# Altium schematic sheet 18V5_efuse.SchDoc
size A4
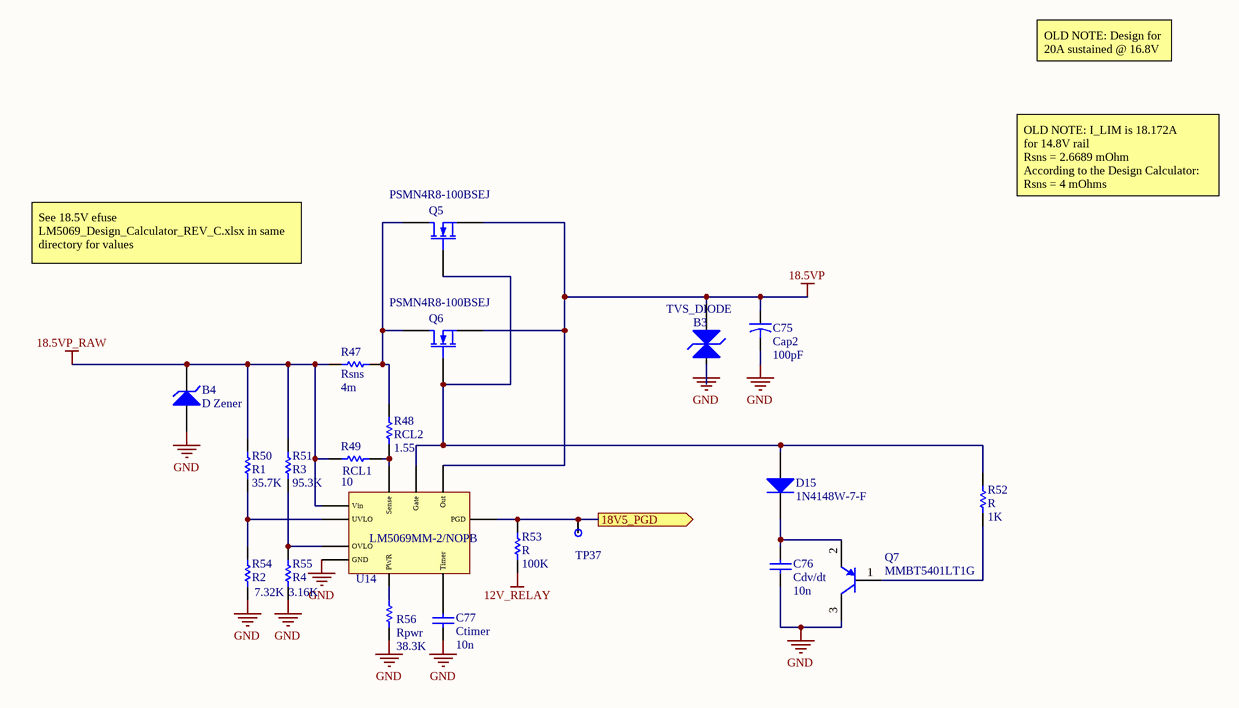
[diagram p0: 18V5_efuse.SchDoc]

## Parts
B3  TVS_DIODE  [SMBJ54A-13-F]
B4  D Zener  [DIODE-0.7]
C75  Cap2  value 100pF  [CAPR5-4X5]
C76  Cdv/dt  value 10n  [RAD-0.3]
C77  Ctimer  value 10n  [RAD-0.3]
D15  1N4148W-7-F  [DIOD-SOD123-2_V]
Q5  PSMN4R8-100BSEJ  [DPAK254P1420X457-3N]
Q6  PSMN4R8-100BSEJ  [DPAK254P1420X457-3N]
Q7  MMBT5401LT1G  [ONSC-SOT-23-3-318-08_V]
R47  Rsns  value 4m  [RESC1608X06N_0603]
R48  RCL2  value 1.55  [RESC1608X06N_0603]
R49  RCL1  value 10  [RESC1608X06N_0603]
R50  R1  value 35.7K  [RESC1608X06N_0603]
R51  R3  value 95.3K  [RESC1608X06N_0603]
R52  R  value 1K  [RESC1608X06N_0603]
R53  R  value 100K  [RESC1608X06N_0603]
R54  R2  value 7.32K  [RESC1608X06N_0603]
R55  R4  value 3.16K  [RESC1608X06N_0603]
R56  Rpwr  value 38.3K  [RESC1608X06N_0603]
TP37  TestPt  [50_MIL_PAD]  (value not drawn)
U14  LM5069MM-2/NOPB  [TSSOP50P490X110-10N]

## Ports
18V5_PGD (out)

## Nets
12V_RELAY: R53.1
18.5VP: B3.2(K) C75.1 Q5.3(S) Q6.3(S) U14.9(Out)
18.5VP_RAW: B4.2(K) R47.1 R49.1 R50.2 R51.2 U14.2(Vin)
GND: B3.1(A) B4.1(A) C75.2 C76.2 C77.1 Q7.3(C) R54.1 R55.1 R56.1 U14.5(GND)
18V5_PGD: R53.2 TP37.1 U14.8(PGD) ; port 18V5_PGD
NetC76_1: C76.1 D15.2(K) Q7.2(E)
NetC77_2: C77.2 U14.6(Timer)
NetD15_1: D15.1(A) Q5.1(G) Q6.1(G) R52.2 U14.10(Gate)
NetQ5_2: Q5.2(D) Q6.2(D) R47.2 R48.2
NetQ7_1: Q7.1(B) R52.1
NetR48_1: R48.1 R49.2 U14.1(Sense)
NetR50_1: R50.1 R54.2 U14.3(UVLO)
NetR51_1: R51.1 R55.2 U14.4(OVLO)
NetR56_2: R56.2 U14.7(PWR)

## Notes on the sheet
- OLD NOTE: Design for 20A sustained @ 16.8V
- OLD NOTE: I_LIM is 18.172A
  for 14.8V rail
  Rsns = 2.6689 mOhm                            According to the Design Calculator: Rsns = 4 mOhms
- See 18.5V efuse LM5069_Design_Calculator_REV_C.xlsx in same directory for values

## Library data of the parts
B3 = TVS_DIODE: TVS Diode; Published: 8-Jun-2000; LatestRevisionDate: 17-Jul-2002; LatestRevisionNote: Re-released for DXP Platform.; PackageVersion: Sep-1996; PackageReference: SMC; Publisher: Altium Limited; PackageDescription: DO-214-AB/SMC; 2 C-Bend Leads; Body 7.9 x 5.9 mm, inc. leads (LxW); Code_JEDEC: DO-214-AB
B4 = D Zener: Zener Diode; Published: 8-Jun-2000; LatestRevisionDate: 17-Jul-2002; LatestRevisionNote: Re-released for DXP Platform.; PackageReference: DIODE-0.7; Publisher: Altium Limited; PackageDescription: Diode, Thru-Hole; 2 Leads; 0.7 in Pin Spacing
C75 = Cap2: Capacitor; Published: 23-Sep-2002; PackageReference: CAPR5-4X5; Publisher: Altium Limited; PackageDescription: Capacitor; 2 Leads
C76 C77 = Cap: Capacitor; Published: 8-Jun-2000; LatestRevisionDate: 17-Jul-2002; LatestRevisionNote: Re-released for DXP Platform.; PackageReference: RAD-0.3; Publisher: Altium Limited; PackageDescription: Radial Cap, Thru-Hole; 2 Leads; 0.3 in Pin Spacing
D15 = CMP-2000-04932-2: Fast Switching Diode, 100 V, 0.15 A, -65 to 150 degC, 2-Pin?SOD123, RoHS, Tape and Reel; Recovery Time: 4ns; Brand: DiodesIncorporated; Unit Weight: 0.000353oz; Max Surge Current: 2A; Peak Reverse Voltage: 100V; Ir - Reverse Current: 1uA; Vf - Forward Voltage: 1.25V; Configuration: Single; If - Forward Current: 0.15A; Product Category: Diodes-GeneralPurpose,Power,Switching; Operating Temperature Range: -65Cto+150C; Packaging: Reel; Manufacturer URL: http://www.diodes.com/; Maximum Operating Temperature: +150C; Height: 1.25mm; Minimum Operating Temperature: -65C; Product: SwitchingDiodes; Package URL: http://www.diodes.com/datasheets/ds18004.pdf; Type: SwitchingDiode; Package Reference: SOD123-2; Width: 1.7mm; Datasheet URL: http://www.farnell.com/datasheets/1915529.pdf; Datasheet Version: Rev. 24-2, 10/2013; Series: 1N4148; Factory Pack Quantity: 3000; Length: 2.85mm; RoHS: True; Manufacturer: DiodesIncorporated; Mounting Style: SMD/SMT; Package / Case: SOD-123
Q5 Q6 = PSMN4R8-100BSEJ: N-Channel MOSFET; Published: 8-Jun-2000; LatestRevisionDate: 17-Jul-2002; LatestRevisionNote: Re-released for DXP Platform.; PackageVersion: 1995/1996; PackageReference: E3; Publisher: Altium Limited; PackageDescription: TO, Flat Index; 3 In-Line, Axial Leads; Body Dia. 4.6mm; Lead Dia. 0.5 mm (max); Supplier 1: Digi-Key; Supplier Part Number 1: 1727-1103-1-ND
Q7 = CMP-1048-00557-1: High Voltage Transistor, PNP Silicon, 3-Pin SOT-23, Pb-Free, Tape and Reel; Manufacturer: On Semiconductor; fT Min (MHz): 100; IC Continuous (A): -0.5; Packing: Tape and Reel; PackageDescription: 3-Pin Small Outline Transistor, Body 2.92 x 1.3 mm, Pitch 0.95 mm; PartNumber: MMBT5401LT1G; DatasheetVersion: Rev. 11; PackageReference: SOT-23-3-318-08; Polarity: PNP; ComponentLink1URL: http://www.onsemi.com/; ComponentLink3URL: http://www.onsemi.cn/pub_link/Collateral/318-08.PDF; ComponentLink3Description: Package Specification; ComponentLink1Description: Manufacturer URL; Mounting Technology: Surface Mount; ComponentLink2URL: http://www.onsemi.cn/pub_link/Collateral/MMBT5401LT1-D.PDF; RoHS: TRUE; ComponentLink2Description: Datasheet; PackageVersion: Rev. AP, 11/2009
R47-R56 = Res1: Resistor; Published: 8-Jun-2000; LatestRevisionDate: 17-Jul-2002; LatestRevisionNote: Re-released for DXP Platform.; PackageReference: AXIAL-0.3; Publisher: Altium Limited; PackageDescription: Axial Device, Thru-Hole; 2 Leads; 0.3 in Pin Spacing
U14 = LM5069MM-2/NOPB: Hot Swap Controller 1-CH 80V N-Channel Positive High Voltage 10-Pin VSSOP T/R; Manufacturer 1: TI National Semiconductor; Min Supply Voltage: 9V; Number of Channels: 1; Output Voltage: 12V; Supplier 1: Digi-Key; Manufacturer Part Number 1: LM5069MM-2/NOPB; Stock 1: 115715; Pricing 1: 1=3.00000, 10=2.69700, 25=2.54920, 100=2.09610, 250=1.88080, 500=1.81280 (USD); RoHS: Yes; Mount: Surface Mount; Case/Package: MSOP; Number of Pins: 10; Min Operating Temperature: -40°C; Max Operating Temperature: 125°C; Packaging: Tape and Reel; Package Quantity: 1000; Max Supply Voltage: 80V; Number of Outputs: 1; Length: 3mm; Height: 0.86mm; Depth: 3.1mm; Width: 3mm; Radiation Hardening: No; Lead Free: Lead Free; REACH SVHC: No SVHC; ComponentLink1URL: https://datasheet.ciiva.com/15099/getdatasheetpartid-628880-15099677.pdf?src-supplier=Verical; ComponentLink1Description: https://datasheet.ciiva.com/15099/getdatasheetpartid-628880-15099677.pdf?src-supplier=Verical; ComponentLink2URL: https://datasheet.ciiva.com/3222/lm5069-3222438.pdf?src-supplier=Avnet; ComponentLink2Description: https://datasheet.ciiva.com/3222/lm5069-3222438.pdf?src-supplier=Avnet; ComponentLink3URL: https://datasheet.ciiva.com/3222/lm5069-3222470.pdf?src-supplier=Avnet; ComponentLink3Description: https://datasheet.ciiva.com/3222/lm5069-3222470.pdf?src-supplier=Avnet; ComponentLink4URL: https://datasheet.ciiva.com/6609/lm5069-6609670.pdf?src-supplier=Digi-Key; ComponentLink4Description: https://datasheet.ciiva.com/6609/lm5069-6609670.pdf?src-supplier=Digi-Key; ComponentLink5URL: https://datasheet.ciiva.com/1511/1642228-1511437.pdf?src-supplier=Element14; ComponentLink5Description: https://datasheet.ciiva.com/1511/1642228-1511437.pdf?src-supplier=Element14; Supplier Part Number 1: LM5069MM-2/NOPBCT-ND